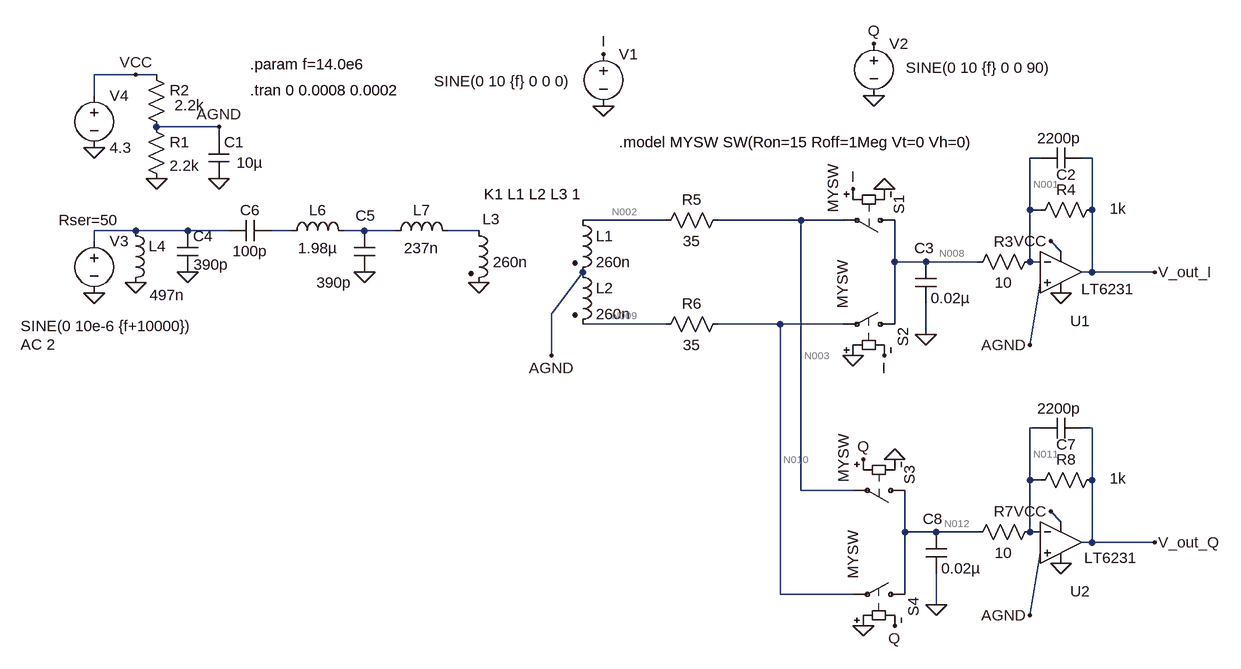
[diagram p0: schematic Tran_SDR_IQ.asc]
Tran_SDR_IQ.asc, the LTspice schematic file:
Version 4
SHEET 1 880 776
WIRE -1072 -192 -1136 -192
WIRE -1040 -192 -1072 -192
WIRE -1136 -160 -1136 -192
WIRE -944 -112 -1040 -112
WIRE -944 -96 -944 -112
WIRE 320 -64 304 -64
WIRE 400 -64 384 -64
WIRE 304 16 304 -64
WIRE 320 16 304 16
WIRE 400 16 400 -64
WIRE -256 32 -384 32
WIRE -48 32 -176 32
WIRE 16 32 -48 32
WIRE -1072 48 -1136 48
WIRE -992 48 -1072 48
WIRE -928 48 -992 48
WIRE -832 48 -864 48
WIRE -720 48 -752 48
WIRE -672 48 -720 48
WIRE -544 48 -592 48
WIRE -1136 64 -1136 48
WIRE 352 80 336 64
WIRE 96 96 96 32
WIRE 144 96 96 96
WIRE 224 96 144 96
WIRE 304 96 304 16
WIRE 320 96 304 96
WIRE 400 112 400 16
WIRE 400 112 384 112
WIRE 496 112 400 112
WIRE -432 176 -384 112
WIRE -256 192 -384 192
WIRE -80 192 -176 192
WIRE 16 192 -80 192
WIRE 96 192 96 96
WIRE 144 208 144 160
WIRE 304 224 320 128
WIRE -432 240 -432 176
WIRE 320 352 304 352
WIRE 400 352 384 352
WIRE 304 432 304 352
WIRE 320 432 304 432
WIRE 400 432 400 352
WIRE -48 448 -48 32
WIRE 32 448 -48 448
WIRE 352 496 336 480
WIRE 112 512 112 448
WIRE 160 512 112 512
WIRE 224 512 160 512
WIRE 304 512 304 432
WIRE 320 512 304 512
WIRE 400 528 400 432
WIRE 400 528 384 528
WIRE 496 528 400 528
WIRE -80 608 -80 192
WIRE 32 608 -80 608
WIRE 112 608 112 512
WIRE 160 624 160 576
WIRE 304 640 320 544
FLAG -1136 144 0
FLAG -544 128 0
FLAG -1136 -80 0
FLAG -1040 -32 0
FLAG -944 -32 0
FLAG -352 -144 0
FLAG 80 -16 0
FLAG 32 240 0
FLAG 64 -160 0
FLAG -944 -112 AGND
FLAG -432 240 AGND
FLAG 304 224 AGND
FLAG -352 -224 I
FLAG 32 -16 I
FLAG 64 -240 Q
FLAG -1072 -192 VCC
FLAG 336 64 VCC
FLAG 352 144 0
FLAG 80 240 I
FLAG 144 208 0
FLAG 496 112 V_out_I
FLAG -1072 128 0
FLAG -992 112 0
FLAG -720 112 0
FLAG 96 400 0
FLAG 48 656 0
FLAG 304 640 AGND
FLAG 48 400 Q
FLAG 336 480 VCC
FLAG 352 560 0
FLAG 96 656 Q
FLAG 160 624 0
FLAG 496 528 V_out_Q
SYMBOL Opamps\\LT6231 352 112 R0
WINDOW 0 14 75 Left 2
WINDOW 3 31 26 Left 2
SYMATTR InstName U1
SYMBOL sw 112 32 R90
WINDOW 0 -39 9 Left 2
WINDOW 3 -86 111 Left 2
SYMATTR InstName S1
SYMATTR Value MYSW
SYMBOL sw 112 192 M270
WINDOW 0 -34 3 Left 2
SYMATTR InstName S2
SYMATTR Value MYSW
SYMBOL voltage -352 -240 R0
WINDOW 123 0 0 Left 0
WINDOW 39 0 0 Left 0
WINDOW 3 -261 58 Left 2
SYMATTR Value SINE(0 10 {f} 0 0 0)
SYMATTR InstName V1
SYMBOL voltage 64 -256 R0
WINDOW 123 0 0 Left 0
WINDOW 39 0 0 Left 0
WINDOW 3 49 53 Left 2
SYMATTR Value SINE(0 10 {f} 0 0 90)
SYMATTR InstName V2
SYMBOL voltage -1136 48 R0
WINDOW 123 -113 175 Left 2
WINDOW 39 -55 -16 Left 2
WINDOW 3 -113 147 Left 2
SYMATTR Value2 AC 2
SYMATTR SpiceLine Rser=50
SYMATTR Value SINE(0 10e-6 {f+10000})
SYMATTR InstName V3
SYMBOL ind2 -400 16 R0
SYMATTR InstName L1
SYMATTR Value 260n
SYMATTR Type ind
SYMBOL ind2 -400 96 R0
SYMATTR InstName L2
SYMATTR Value 260n
SYMATTR Type ind
SYMBOL ind2 -560 32 R0
WINDOW 0 22 -2 Left 2
WINDOW 3 38 64 Left 2
SYMATTR InstName L3
SYMATTR Value 260n
SYMATTR Type ind
SYMBOL res -1056 -128 R0
SYMATTR InstName R1
SYMATTR Value 2.2k
SYMBOL res -1056 -208 R0
WINDOW 3 44 63 Left 2
SYMATTR Value 2.2k
SYMATTR InstName R2
SYMBOL cap -960 -96 R0
WINDOW 3 43 39 Left 2
SYMATTR Value 10µ
SYMATTR InstName C1
SYMBOL voltage -1136 -176 R0
WINDOW 123 0 0 Left 0
WINDOW 39 0 0 Left 0
SYMATTR InstName V4
SYMATTR Value 4.3
SYMBOL res 320 80 R90
WINDOW 0 0 56 VBottom 2
WINDOW 3 32 56 VTop 2
SYMATTR InstName R3
SYMATTR Value 10
SYMBOL res 416 0 R90
WINDOW 0 0 56 VBottom 2
WINDOW 3 -2 -24 VTop 2
SYMATTR InstName R4
SYMATTR Value 1k
SYMBOL cap 384 -80 R90
WINDOW 0 57 24 VBottom 2
WINDOW 3 -30 35 VTop 2
SYMATTR InstName C2
SYMATTR Value 2200p
SYMBOL cap 128 96 R0
WINDOW 0 -2 -21 Left 2
SYMATTR InstName C3
SYMATTR Value 0.02µ
SYMBOL cap -1008 48 R0
WINDOW 3 25 52 Left 2
SYMATTR Value 390p
SYMATTR InstName C4
SYMBOL cap -736 48 R0
WINDOW 0 2 -23 Left 2
WINDOW 3 -58 80 Left 2
SYMATTR InstName C5
SYMATTR Value 390p
SYMBOL cap -864 32 R90
WINDOW 0 0 32 VBottom 2
WINDOW 3 32 32 VTop 2
SYMATTR InstName C6
SYMATTR Value 100p
SYMBOL ind -1088 32 R0
WINDOW 3 37 115 Left 2
SYMATTR Value 497n
SYMATTR InstName L4
SYMBOL ind -848 64 R270
WINDOW 0 32 56 VTop 2
WINDOW 3 5 56 VBottom 2
SYMATTR InstName L6
SYMATTR Value 1.98µ
SYMBOL Opamps\\LT6231 352 528 R0
WINDOW 0 14 75 Left 2
WINDOW 3 36 24 Left 2
SYMATTR InstName U2
SYMBOL sw 128 448 R90
WINDOW 0 -39 9 Left 2
WINDOW 3 -86 111 Left 2
SYMATTR InstName S3
SYMATTR Value MYSW
SYMBOL sw 128 608 M270
WINDOW 0 -34 3 Left 2
SYMATTR InstName S4
SYMATTR Value MYSW
SYMBOL res 320 496 R90
WINDOW 0 0 56 VBottom 2
WINDOW 3 32 56 VTop 2
SYMATTR InstName R7
SYMATTR Value 10
SYMBOL res 416 416 R90
WINDOW 0 0 56 VBottom 2
WINDOW 3 -2 -24 VTop 2
SYMATTR InstName R8
SYMATTR Value 1k
SYMBOL cap 384 336 R90
WINDOW 0 57 24 VBottom 2
WINDOW 3 -30 35 VTop 2
SYMATTR InstName C7
SYMATTR Value 2200p
SYMBOL cap 144 512 R0
WINDOW 0 -5 -20 Left 2
SYMATTR InstName C8
SYMATTR Value 0.02µ
SYMBOL res -160 16 R90
WINDOW 0 0 56 VBottom 2
WINDOW 3 32 56 VTop 2
SYMATTR InstName R5
SYMATTR Value 35
SYMBOL res -160 176 R90
WINDOW 0 0 56 VBottom 2
WINDOW 3 32 56 VTop 2
SYMATTR InstName R6
SYMATTR Value 35
SYMBOL ind -688 64 R270
WINDOW 0 32 56 VTop 2
WINDOW 3 5 56 VBottom 2
SYMATTR InstName L7
SYMATTR Value 237n
TEXT -896 -168 Left 2 !.tran 0 0.0008 0.0002
TEXT -328 -88 Left 2 !.model MYSW SW(Ron=15 Roff=1Meg Vt=0 Vh=0)
TEXT -536 -8 Left 2 !K1 L1 L2 L3 1
TEXT -896 -208 Left 2 !.param f=14.0e6

The netlist it stands for:
* Tran_SDR_IQ.asc
XU1 AGND N001 V_out_I VCC 0 LT6231  ; pins In+ In- OUT V+ V-
S1 N008 N003 I 0 MYSW
S2 N008 N010 0 I MYSW
V1 I 0 SINE(0 10 {f} 0 0 0)
V2 Q 0 SINE(0 10 {f} 0 0 90)
V3 N004 0 SINE(0 10e-6 {f+10000}) AC 2 Rser=50
L1 N002 AGND 260n
L2 AGND N009 260n
L3 N007 0 260n
R1 AGND 0 2.2k
R2 VCC AGND 2.2k
C1 AGND 0 10µ
V4 VCC 0 4.3
R3 N001 N008 10
R4 V_out_I N001 1k
C2 V_out_I N001 2200p
C3 N008 0 0.02µ
C4 N004 0 390p
C5 N006 0 390p
C6 N005 N004 100p
L4 N004 0 497n
L6 N005 N006 1.98µ
XU2 AGND N011 V_out_Q VCC 0 LT6231  ; pins In+ In- OUT V+ V-
S3 N012 N003 Q 0 MYSW
S4 N012 N010 0 Q MYSW
R7 N011 N012 10
R8 V_out_Q N011 1k
C7 V_out_Q N011 2200p
C8 N012 0 0.02µ
R5 N003 N002 35
R6 N010 N009 35
L7 N006 N007 237n
.tran 0 0.0008 0.0002
.model MYSW SW(Ron=15 Roff=1Meg Vt=0 Vh=0)
K1 L1 L2 L3 1
.param f=14.0e6
.lib LTC2.lib
.backanno
.end

* Results of the author's LTspice run, read from the files saved beside the schematic
* Operating Point, zero values left out:
*   V(n001) = 2.139 V
*   V(agnd) = 2.139 V
*   V(v_out_i) = 2.144 V
*   V(vcc) = 4.3 V
*   V(n008) = 2.139 V
*   V(n003) = 2.139 V
*   V(n010) = 2.139 V
*   V(q) = 10 V
*   V(n002) = 2.139 V
*   V(n009) = 2.139 V
*   V(n011) = 2.139 V
*   V(v_out_q) = 2.144 V
*   V(n012) = 2.139 V
*   I(L1) = -3.525 nA
*   I(R5) = -3.525 nA
*   I(R8) = 4.997 µA
*   I(R7) = -3.525 nA
*   I(R4) = 5 µA
*   I(R2) = 982.3 µA
*   I(R1) = 972.3 µA
*   I(S3) = 3.525 nA
*   I(V4) = -7.137 mA
*   Ix(u1:1) = 5 µA
*   Ix(u1:2) = 5 µA
*   Ix(u1:3) = -5 µA
*   Ix(u1:4) = 3.077 mA
*   Ix(u1:5) = -3.082 mA
*   Ix(u2:1) = 5 µA
*   Ix(u2:2) = 5 µA
*   Ix(u2:3) = -4.997 µA
*   Ix(u2:4) = 3.077 mA
*   Ix(u2:5) = -3.082 mA